# EAGLE design MX25R6435F_Breakout (EAGLE 8.6.0)
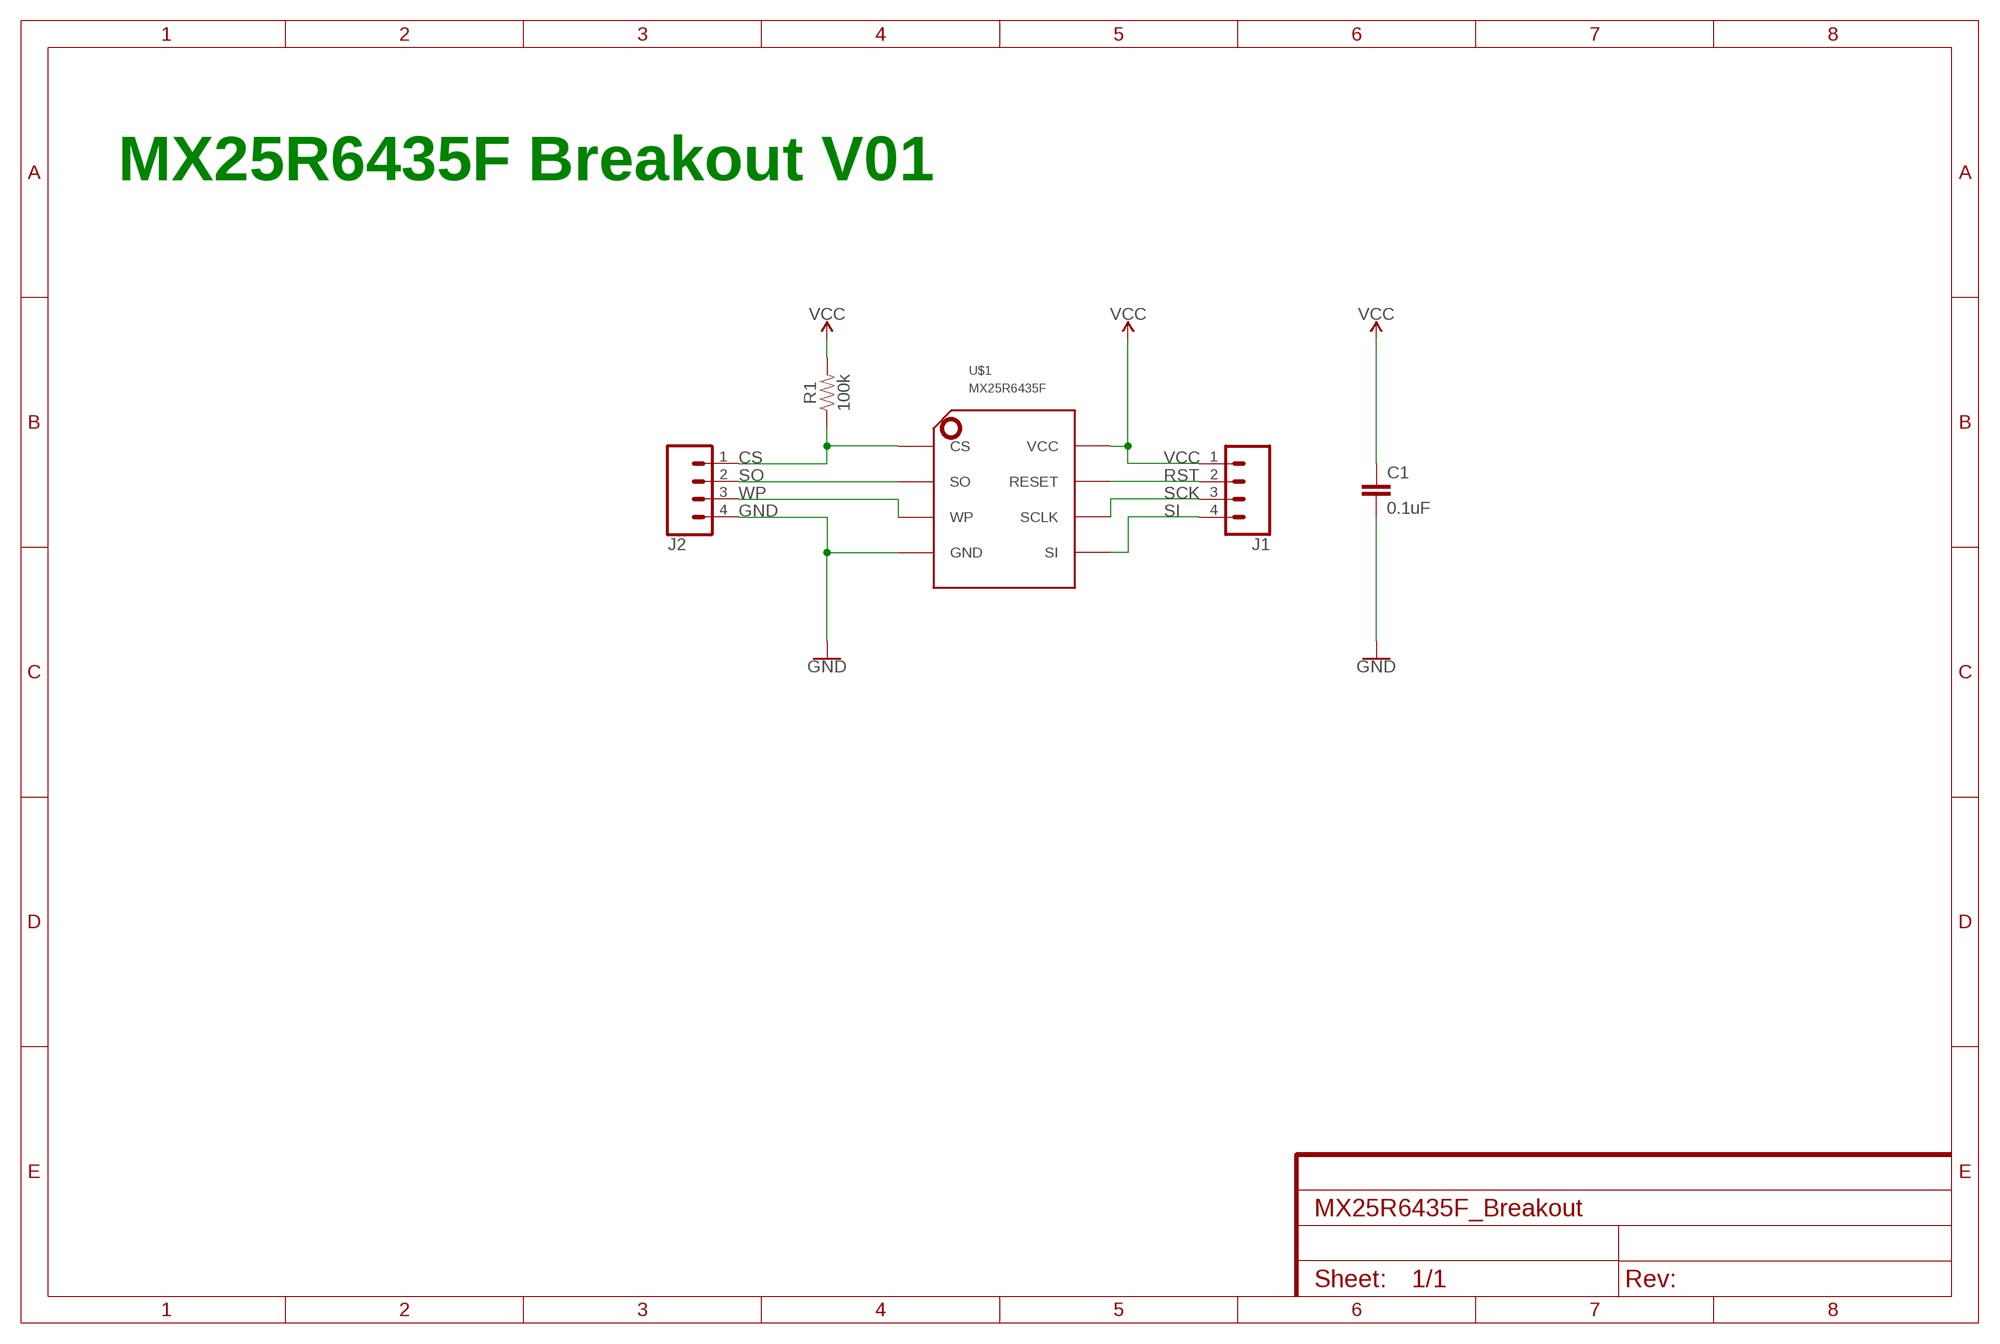
[diagram p0: schematic, sheet 1]

## Parts
C1  0.1uF  0.1UF-0603-25V-5%  [0603]
J1  CONN_04  [1X04]
J2  CONN_04  [1X04]
R1  100k  100KOHM-0603-1/10W-1%  [0603]
U$1  MX25R6435F  [8-USON_MX25R6435F]

## Nets
CS: J2.1 R1.1 U$1.CS$1(CS)
GND: C1.2 J2.4 U$1.GND$4(GND)
RST: J1.2 U$1.RESET$7(RESET)
SCK: J1.3 U$1.SCLK$6(SCLK)
SI: J1.4 U$1.SI$5(SI)
SO: J2.2 U$1.SO$2(SO)
VCC: C1.1 J1.1 R1.2 U$1.VCC$8(VCC)
WP: J2.3 U$1.WP$3(WP)

## Notes on the sheet
- MX25R6435F Breakout V01

## Library data of the parts
C1 = SparkFun-Capacitors:0.1UF: 0.1µF ceramic capacitors A capacitor is a passive two-terminal electrical component used to store electrical energy temporarily in an electric field.; PROD_ID: CAP-08604
J1 J2 = SparkFun-Connectors:CONN_04: Multi connection point. Often used as Generic Header-pin footprint for 0.1 inch spaced/style header connections On any of the 0.1 inch spaced packages, you can populate with these: Break Away Headers - Straight <https://www.sparkfun.com/products/116> (PRT-00116) Break Away Male Headers - Right Angle <https://www.sparkfun.com/products/553> (PRT-00553) Female Headers <https://www.sparkfun.com/products/115> (PRT-00115) Break Away Headers - Machine Pin <https://www.sparkfun.com/products/117> (PRT-00117) Break Away Female Headers - Swiss Machine Pin <https://www.sparkfun.com/products/743> (PRT-00743) For SCREWTERMINALS and SPRING TERMINALS visit here: Screw Terimnals on SparkFun.com <https://www.sparkfun.com/search/results?term=Screw+Terminals> (5mm/3.5mm/2.54mm spacing) This device is also useful as a general connection point to wire up your design to another part of your project. Our various solder wires solder well into these plated through hole pads. Hook-Up Wire - Assortment (Stranded, 22 AWG) <https://www.sparkfun.com/products/11375> (PRT-11375) Hook-Up Wire - Assortment (Solid Core, 22 AWG) <https://www.sparkfun.com/products/11367> (PRT-11367) View the entire wire category on our website here <https://www.sparkfun.com/categories/141> Special notes: Molex polarized connector foot print use with SKU : PRT-08231 with associated crimp pins and housings. 1MM SMD Version SKU: PRT-10208; PROD_ID: CONN-09696
R1 = SparkFun-Resistors:100KOHM: 100kΩ resistor A resistor is a passive two-terminal electrical component that implements electrical resistance as a circuit element. Resistors act to reduce current flow, and, at the same time, act to lower voltage levels within circuits. - Wikipedia; PROD_ID: RES-07828
U$1 = MX25R6435F:MX25R6435F: MX25R6435F Digikey: ‎1092-1173-ND‎‏

## Board
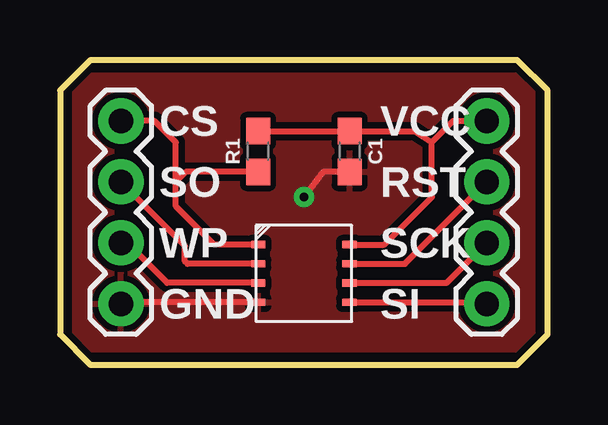
[diagram p1: board, top side]
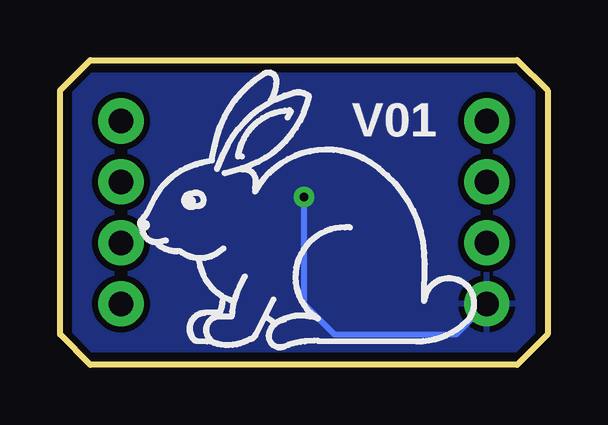
[diagram p2: board, bottom side, seen from below]

Size 20.32 x 12.7 mm. Coordinates in mm from the lower left corner, seen from the top.
Outline: 1.27,0 19.05,0 20.32,1.27 20.32,11.43 19.05,12.7 1.27,12.7 0,11.43 0,1.27 1.27,0
Copper layers (1*16): Top 0.035mm / dielectric 1.5mm / Bottom 0.035mm
Design rules "Modified-SparkFun-2-layer-STANDARD": minimum track width 8mil, minimum drill 0.3mm, track to track 10mil, track to pad 8mil, pad to pad 8mil, via to via 10mil, smd to smd 8mil, copper to edge 8mil, drill to drill 8mil, minimum pad ring 10mil, minimum via ring 10mil, stop-mask expansion 4mil, vias tented up to drill 25mil, thermal gap 10mil

### Footprints (pad centres in the part's own frame; a part is rotated, then mirrored left to right if it is on the bottom)
0603 = smd 1.1 x 1: 1 -0.85,0; 2 0.85,0
1X04 = drill 1.016 pad 1.88: 1 0,0; 2 2.54,0; 3 5.08,0; 4 7.62,0
8-USON_MX25R6435F = smd 0.6 x 0.3: CS$1 -1.9,1.2; GND$4 -1.9,-1.2; RESET$7 1.9,0.4; SCLK$6 1.9,-0.4; SI$5 1.9,-1.2; SO$2 -1.9,0.4; VCC$8 1.9,1.2; WP$3 -1.9,-0.4

### Placement (x,y rotation side)
C1  12.06,8.89 270 top
J1  17.78,10.16 270 top
J2  2.54,10.16 270 top
R1  8.26,8.89 90 top
U$1  10.16,3.81 0 top

### Tracks (layer width: path | path; a pad name or v marks a point on that pad's centre or on a via)
CS
  Top 0.254: U$1.CS$1 6.42,5.01 4.83,6.6 4.83,7.62 | J2.1 3.94,10.16 4.83,9.27 4.83,7.62 | R1.1 5.25,8.04 4.83,7.62
GND  (via drill 0.35)
  Top 0.254: U$1.GND$4 2.61,2.61 J2.4 | C1.2 10.96,8.04 v10.16,6.99
  Bottom 0.254: v10.16,6.99 10.16,2.54 8.89,1.27 3.81,1.27 J2.4
  pour Top (isolate 0.254): 0.64,11.43 1.27,12.06 19.05,12.06 19.68,11.43 19.68,1.27 19.05,0.64 1.27,0.64 0.64,1.27
  pour Bottom (isolate 0.254): 0.64,1.27 1.27,0.64 19.05,0.64 19.68,1.27 19.68,11.43 19.05,12.06 1.27,12.06 0.64,11.43
RST
  Top 0.254: U$1.RESET$7 14.37,4.21 J1.2
SCK
  Top 0.254: U$1.SCLK$6 16.11,3.41 J1.3
SI
  Top 0.254: U$1.SI$5 17.71,2.61 J1.4
SO
  Top 0.254: U$1.SO$2 5.32,4.21 5.21,4.32 5.21,4.95 J2.2
VCC
  Top 0.254: R1.2 C1.1 14.77,9.74 15.49,9.27 | U$1.VCC$8 13.52,5.01 15.49,6.99 15.49,9.27 | 15.49,9.27 16.38,10.16 J1.1
WP
  Top 0.254: U$1.WP$3 4.46,3.41 2.79,5.08 J2.3

### Text on the board
tPlace: CS | VCC | SO | RST | WP | SCK | GND | SI
bPlace: V01